# EAGLE design TEK-8x8 (EAGLE 7.2.0)
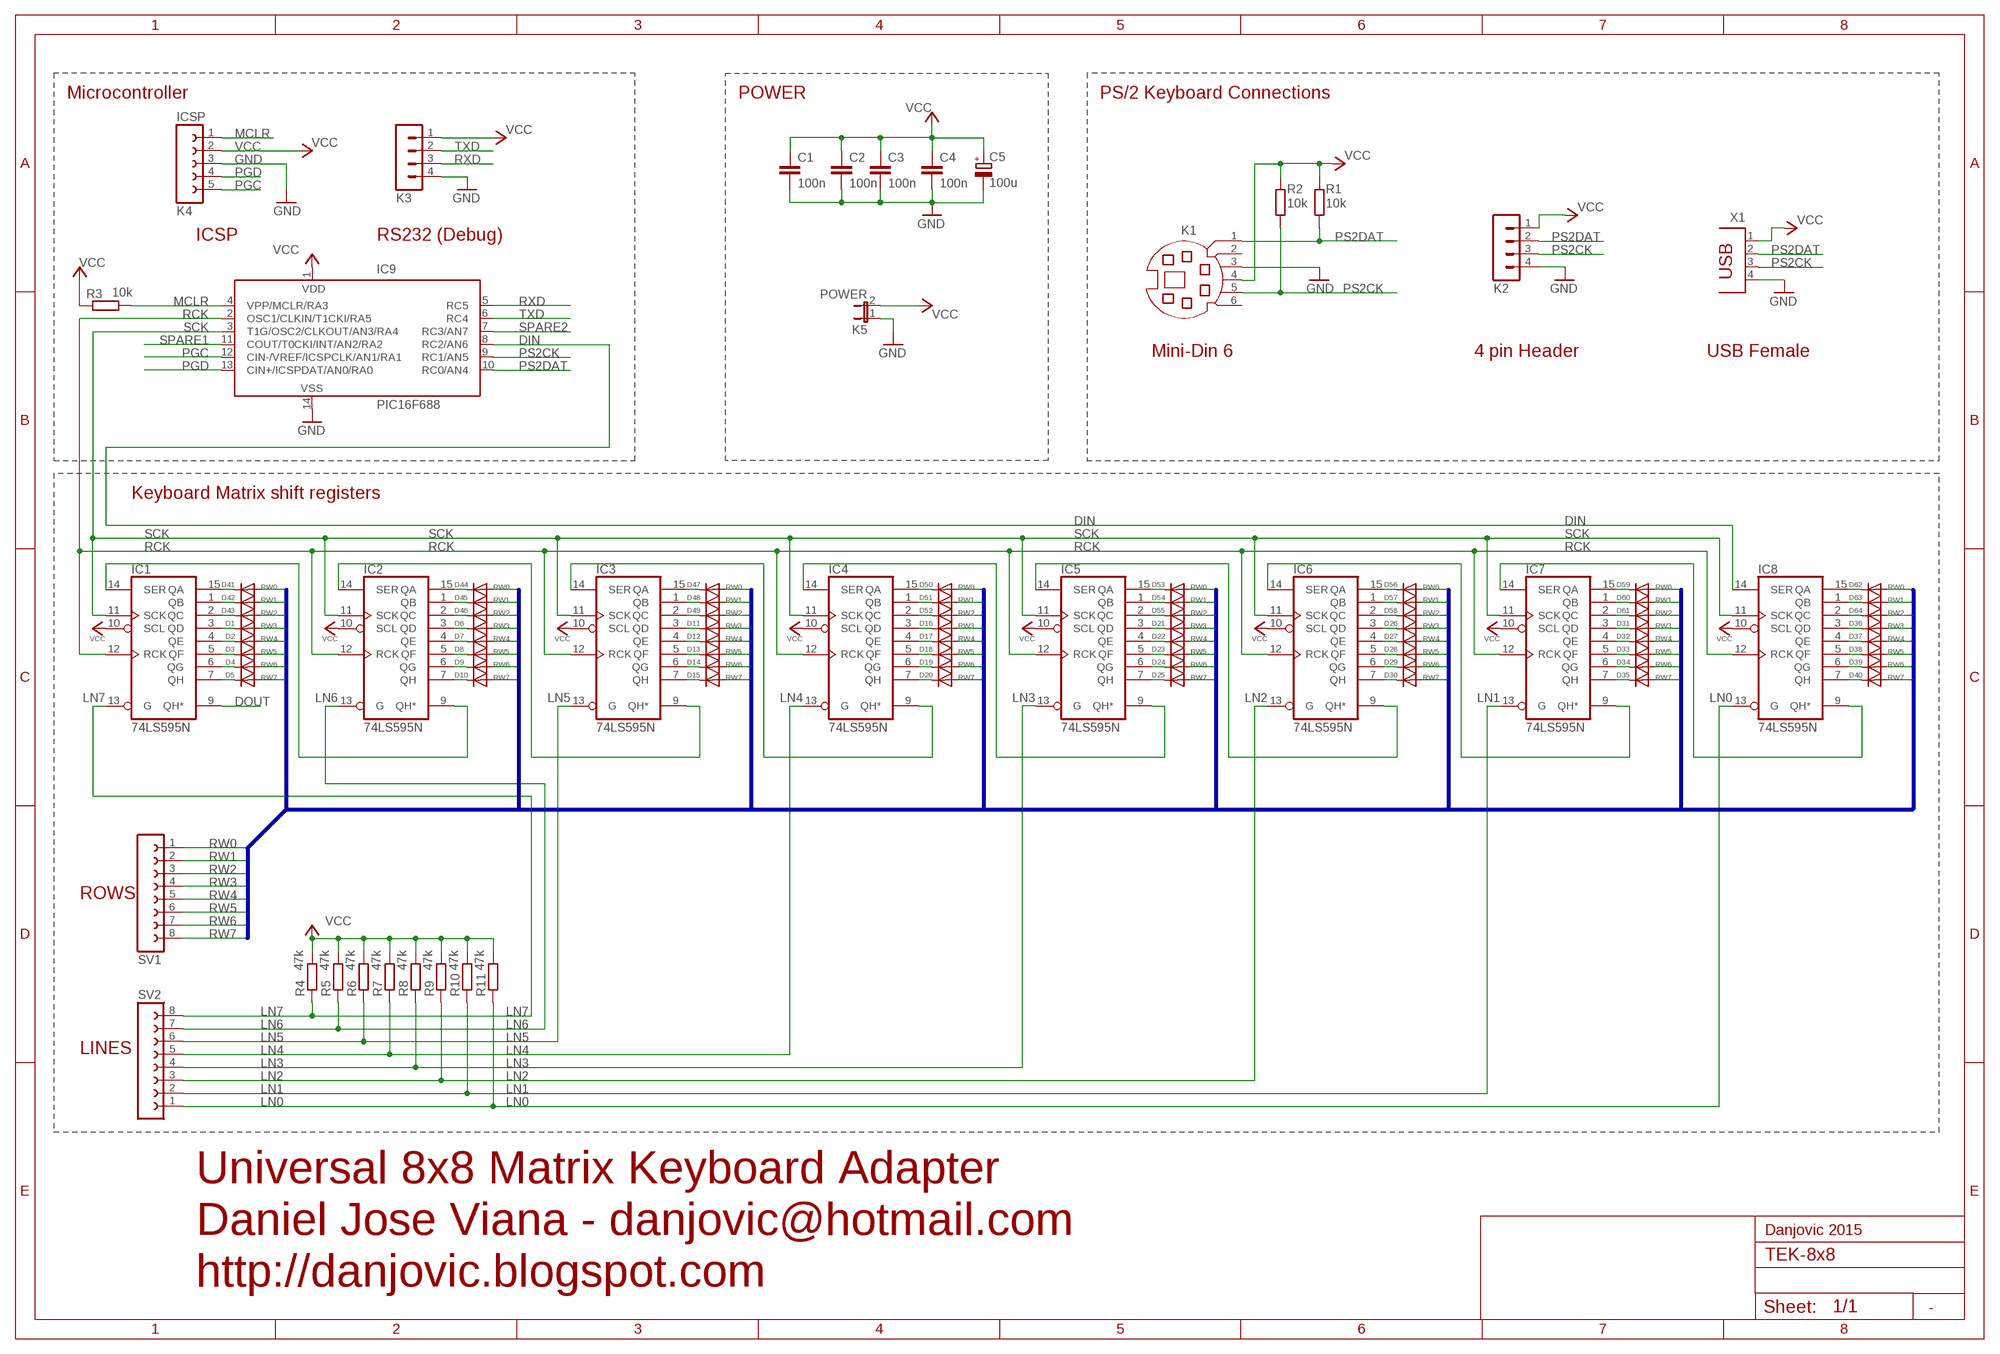
[diagram p0: schematic, sheet 1]

## Parts
C1  100n  C-EU050-030X075  [C050-030X075]
C2  100n  C-EU050-030X075  [C050-030X075]
C3  100n  C-EU050-030X075  [C050-030X075]
C4  100n  C-EU050-030X075  [C050-030X075]
C5  100u  CPOL-EUE3.5-10  [E3,5-10]
D1  DIODE-D-2.5  [D-2.5]
D2  DIODE-D-2.5  [D-2.5]
D3  DIODE-D-2.5  [D-2.5]
D4  DIODE-D-2.5  [D-2.5]
D5  DIODE-D-2.5  [D-2.5]
D6  DIODE-D-2.5  [D-2.5]
D7  DIODE-D-2.5  [D-2.5]
D8  DIODE-D-2.5  [D-2.5]
D9  DIODE-D-2.5  [D-2.5]
D10  DIODE-D-2.5  [D-2.5]
D11  DIODE-D-2.5  [D-2.5]
D12  DIODE-D-2.5  [D-2.5]
D13  DIODE-D-2.5  [D-2.5]
D14  DIODE-D-2.5  [D-2.5]
D15  DIODE-D-2.5  [D-2.5]
D16  DIODE-D-2.5  [D-2.5]
D17  DIODE-D-2.5  [D-2.5]
D18  DIODE-D-2.5  [D-2.5]
D19  DIODE-D-2.5  [D-2.5]
D20  DIODE-D-2.5  [D-2.5]
D21  DIODE-D-2.5  [D-2.5]
D22  DIODE-D-2.5  [D-2.5]
D23  DIODE-D-2.5  [D-2.5]
D24  DIODE-D-2.5  [D-2.5]
D25  DIODE-D-2.5  [D-2.5]
D26  DIODE-D-2.5  [D-2.5]
D27  DIODE-D-2.5  [D-2.5]
D28  DIODE-D-2.5  [D-2.5]
D29  DIODE-D-2.5  [D-2.5]
D30  DIODE-D-2.5  [D-2.5]
D31  DIODE-D-2.5  [D-2.5]
D32  DIODE-D-2.5  [D-2.5]
D33  DIODE-D-2.5  [D-2.5]
D34  DIODE-D-2.5  [D-2.5]
D35  DIODE-D-2.5  [D-2.5]
D36  DIODE-D-2.5  [D-2.5]
D37  DIODE-D-2.5  [D-2.5]
D38  DIODE-D-2.5  [D-2.5]
D39  DIODE-D-2.5  [D-2.5]
D40  DIODE-D-2.5  [D-2.5]
D41  DIODE-D-2.5  [D-2.5]
D42  DIODE-D-2.5  [D-2.5]
D43  DIODE-D-2.5  [D-2.5]
D44  DIODE-D-2.5  [D-2.5]
D45  DIODE-D-2.5  [D-2.5]
D46  DIODE-D-2.5  [D-2.5]
D47  DIODE-D-2.5  [D-2.5]
D48  DIODE-D-2.5  [D-2.5]
D49  DIODE-D-2.5  [D-2.5]
D50  DIODE-D-2.5  [D-2.5]
D51  DIODE-D-2.5  [D-2.5]
D52  DIODE-D-2.5  [D-2.5]
D53  DIODE-D-2.5  [D-2.5]
D54  DIODE-D-2.5  [D-2.5]
D55  DIODE-D-2.5  [D-2.5]
D56  DIODE-D-2.5  [D-2.5]
D57  DIODE-D-2.5  [D-2.5]
D58  DIODE-D-2.5  [D-2.5]
D59  DIODE-D-2.5  [D-2.5]
D60  DIODE-D-2.5  [D-2.5]
D61  DIODE-D-2.5  [D-2.5]
D62  DIODE-D-2.5  [D-2.5]
D63  DIODE-D-2.5  [D-2.5]
D64  DIODE-D-2.5  [D-2.5]
IC1  74LS595N  [DIL16]
IC2  74LS595N  [DIL16]
IC3  74LS595N  [DIL16]
IC4  74LS595N  [DIL16]
IC5  74LS595N  [DIL16]
IC6  74LS595N  [DIL16]
IC7  74LS595N  [DIL16]
IC8  74LS595N  [DIL16]
IC9  PIC16F688  PIC16F676P  [DIL14]
K1  MD06SS  [MDIN06SS]
K2  MA04-1  [MA04-1]
K3  MA04-1  [MA04-1]
K4  ICSP  FE05-1  [FE05-1]
K5  POWER  JP1E  [JP1]
R1  10k  R-EU_0204/7  [0204/7]
R2  10k  R-EU_0204/7  [0204/7]
R3  10k  R-EU_0204/7  [0204/7]
R4  47k  R-EU_0204/7  [0204/7]
R5  47k  R-EU_0204/7  [0204/7]
R6  47k  R-EU_0204/7  [0204/7]
R7  47k  R-EU_0204/7  [0204/7]
R8  47k  R-EU_0204/7  [0204/7]
R9  47k  R-EU_0204/7  [0204/7]
R10  47k  R-EU_0204/7  [0204/7]
R11  47k  R-EU_0204/7  [0204/7]
SV1  FE08-1  [FE08]
SV2  FE08-1  [FE08]
X1  PN87520  [PN87520]

## Nets
DIN: IC8.14(SER) IC9.8(RC2/AN6)
DOUT: IC1.9(QH*)
GND: C1.2 C2.2 C3.2 C4.2 C5.- IC9.14(VSS) K1.3 K2.4 K3.4 K4.3 K5.1 X1.4
LN0: IC8.13(G) R11.1 SV2.1
LN1: IC7.13(G) R10.1 SV2.2
LN2: IC6.13(G) R9.1 SV2.3
LN3: IC5.13(G) R8.1 SV2.4
LN4: IC4.13(G) R7.1 SV2.5
LN5: IC3.13(G) R6.1 SV2.6
LN6: IC2.13(G) R5.1 SV2.7
LN7: IC1.13(G) R4.1 SV2.8
MCLR: IC9.4(VPP/MCLR/RA3) K4.1 R3.1
N$1: D62.C IC8.15(QA)
N$2: D36.C IC8.3(QD)
N$3: D37.C IC8.4(QE)
N$4: D38.C IC8.5(QF)
N$5: D39.C IC8.6(QG)
N$6: D40.C IC8.7(QH)
N$7: D31.C IC7.3(QD)
N$8: D32.C IC7.4(QE)
N$9: D33.C IC7.5(QF)
N$10: D34.C IC7.6(QG)
N$11: D35.C IC7.7(QH)
N$12: IC1.14(SER) IC2.9(QH*)
N$13: D26.C IC6.3(QD)
N$14: D27.C IC6.4(QE)
N$15: D28.C IC6.5(QF)
N$16: IC4.14(SER) IC5.9(QH*)
N$17: D29.C IC6.6(QG)
N$18: IC2.14(SER) IC3.9(QH*)
N$19: D30.C IC6.7(QH)
N$20: D21.C IC5.3(QD)
N$21: D22.C IC5.4(QE)
N$22: D23.C IC5.5(QF)
N$23: IC5.14(SER) IC6.9(QH*)
N$24: D24.C IC5.6(QG)
N$25: D25.C IC5.7(QH)
N$26: D16.C IC4.3(QD)
N$27: D17.C IC4.4(QE)
N$28: D18.C IC4.5(QF)
N$29: IC3.14(SER) IC4.9(QH*)
N$30: D19.C IC4.6(QG)
N$31: D20.C IC4.7(QH)
N$32: D11.C IC3.3(QD)
N$33: D12.C IC3.4(QE)
N$34: D13.C IC3.5(QF)
N$35: D14.C IC3.6(QG)
N$36: D15.C IC3.7(QH)
N$37: D6.C IC2.3(QD)
N$38: D7.C IC2.4(QE)
N$39: D8.C IC2.5(QF)
N$40: D9.C IC2.6(QG)
N$41: D10.C IC2.7(QH)
N$42: D1.C IC1.3(QD)
N$43: D2.C IC1.4(QE)
N$44: IC6.14(SER) IC7.9(QH*)
N$45: D3.C IC1.5(QF)
N$46: D4.C IC1.6(QG)
N$47: D5.C IC1.7(QH)
N$48: D63.C IC8.1(QB)
N$49: IC7.14(SER) IC8.9(QH*)
N$50: D64.C IC8.2(QC)
N$51: D59.C IC7.15(QA)
N$52: D60.C IC7.1(QB)
N$53: D61.C IC7.2(QC)
N$54: D56.C IC6.15(QA)
N$55: D57.C IC6.1(QB)
N$56: D58.C IC6.2(QC)
N$57: D53.C IC5.15(QA)
N$58: D54.C IC5.1(QB)
N$59: D55.C IC5.2(QC)
N$60: D50.C IC4.15(QA)
N$61: D51.C IC4.1(QB)
N$62: D52.C IC4.2(QC)
N$63: D44.C IC2.15(QA)
N$64: D45.C IC2.1(QB)
N$65: D46.C IC2.2(QC)
N$66: D41.C IC1.15(QA)
N$67: D42.C IC1.1(QB)
N$68: D43.C IC1.2(QC)
N$69: D47.C IC3.15(QA)
N$70: D48.C IC3.1(QB)
N$71: D49.C IC3.2(QC)
PGC: IC9.12(CIN-/VREF/ICSPCLK/AN1/RA1) K4.5
PGD: IC9.13(CIN+/ICSPDAT/AN0/RA0) K4.4
PS2CK: IC9.9(RC1/AN5) K1.5 K2.3 R2.1 X1.3
PS2DAT: IC9.10(RC0/AN4) K1.1 K2.2 R1.1 X1.2
RCK: IC1.12(RCK) IC2.12(RCK) IC3.12(RCK) IC4.12(RCK) IC5.12(RCK) IC6.12(RCK) IC7.12(RCK) IC8.12(RCK) IC9.2(OSC1/CLKIN/T1CKI/RA5)
RW0: D41.A D44.A D47.A D50.A D53.A D56.A D59.A D62.A SV1.1
RW1: D42.A D45.A D48.A D51.A D54.A D57.A D60.A D63.A SV1.2
RW2: D43.A D46.A D49.A D52.A D55.A D58.A D61.A D64.A SV1.3
RW3: D1.A D6.A D11.A D16.A D21.A D26.A D31.A D36.A SV1.4
RW4: D2.A D7.A D12.A D17.A D22.A D27.A D32.A D37.A SV1.5
RW5: D3.A D8.A D13.A D18.A D23.A D28.A D33.A D38.A SV1.6
RW6: D4.A D9.A D14.A D19.A D24.A D29.A D34.A D39.A SV1.7
RW7: D5.A D10.A D15.A D20.A D25.A D30.A D35.A D40.A SV1.8
RXD: IC9.5(RC5) K3.3
SCK: IC1.11(SCK) IC2.11(SCK) IC3.11(SCK) IC4.11(SCK) IC5.11(SCK) IC6.11(SCK) IC7.11(SCK) IC8.11(SCK) IC9.3(T1G/OSC2/CLKOUT/AN3/RA4)
SPARE1: IC9.11(COUT/T0CKI/INT/AN2/RA2)
SPARE2: IC9.7(RC3/AN7)
TXD: IC9.6(RC4) K3.2
VCC: C1.1 C2.1 C3.1 C4.1 C5.+ IC1.10(SCL) IC2.10(SCL) IC3.10(SCL) IC4.10(SCL) IC5.10(SCL) IC6.10(SCL) IC7.10(SCL) IC8.10(SCL) IC9.1(VDD) K1.4 K2.1 K3.1 K4.2 K5.2 R1.2 R2.2 R3.2 R4.2 R5.2 R6.2 R7.2 R8.2 R9.2 R10.2 R11.2 X1.1
Unconnected: K1.2 K1.6

## Buses
R[0..7]

## Notes on the sheet
- Microcontroller | POWER | PS/2 Keyboard Connections
- ICSP | RS232 (Debug)
- Mini-Din 6 | 4 pin Header | USB Female
- Keyboard Matrix shift registers
- ROWS
- LINES
- Universal 8x8 Matrix Keyboard Adapter
- Daniel Jose Viana - danjovic@hotmail.com | Danjovic 2015
- http://danjovic.blogspot.com
- -

## Power pins joined to a net without a drawn wire
GND: IC1.8(GND) IC2.8(GND) IC3.8(GND) IC4.8(GND) IC5.8(GND) IC6.8(GND) IC7.8(GND) IC8.8(GND)
VCC: IC1.16(VCC) IC2.16(VCC) IC3.16(VCC) IC4.16(VCC) IC5.16(VCC) IC6.16(VCC) IC7.16(VCC) IC8.16(VCC)

## Library data of the parts
C1-C4 = rcl:C-EU: CAPACITOR, European symbol
C5 = rcl:CPOL-EU: POLARIZED CAPACITOR, European symbol
D1-D64 = diode:DIODE-: DIODE
IC1-IC8 = 74xx-us:74*595: 8-bit SHIFT REGISTER, output latch
IC9 = microchip:PIC16F676: 14-Pin, Flash-Based 8-Bit CMOS Microcontroller High Performance RISC CPU: * Only 35 instructions to learn - All single-cycle instructions except branches * Operating speed: - DC - 20 MHz oscillator/clock input - DC - 200 ns instruction cycle * Internal and external oscillator options - Precision Internal 4 MHz oscillator factory calibrated to ±1% - External Oscillator support for crystals and resonators - 5?s wake-up from SLEEP, 3.0V, typical * Power saving SLEEP mode * Wide operating voltage range - 2.0V to 5.5V * Industrial and Extended temperature range * Low power Power-on Reset (POR) * Power-up Timer (PWRT) and Oscillator Start-up Timer (OST) * Brown-out Detect (BOD) * Watchdog Timer (WDT) with independent oscillator for reliable operation * Multiplexed MCLR/Input-pin * Interrupt-on-pin change * Individual programmable weak pull-ups * Programmable code protection * High Endurance FLASH/EEPROM Cell - 100,000 write FLASH endurance - 1,000,000 write EEPROM endurance - FLASH/Data EEPROM Retention: > 40 years * Standby Current: - 1 nA @ 2.0V, typical * Operating Current: - 8.5?A @ 32 kHz, 2.0V, typical - 100?A @ 1 MHz, 2.0V, typical * Watchdog Timer Current - 300 nA @ 2.0V, typical * Timer1 oscillator current: - 4?A @ 32 kHz, 2.0V, typical * 12 I/O pins with individual direction control * High current sink/source for direct LED drive * Analog-to-Digital Converter module (PIC16F676): - 10-bit resolution - Programmable 8-channel input - Voltage reference input * In-Circuit Serial ProgrammingTM (ICSPTM) via two pins Source: http://ww1.microchip.com/downloads/en/DeviceDoc/40039E.pdf; MF: MICROCHIP; MPN: PIC16F676-I/P; OC_FARNELL: 9760512; OC_NEWARK: 54K2829
K1 = con-yamaichi:MD06SS: YAMAICHI CONNECTOR; OC_FARNELL: unknown; OC_NEWARK: unknown
K2 K3 = con-lstb:MA04-1: PIN HEADER; OC_FARNELL: unknown; OC_NEWARK: unknown
K4 = con-lsta:FE05-1: FEMALE HEADER; OC_FARNELL: unknown; OC_NEWARK: unknown
K5 = jumper:JP1E: JUMPER
R1-R11 = rcl:R-EU_: RESISTOR, European symbol
SV1 SV2 = con-lsta:FE08-1: FEMALE HEADER; OC_FARNELL: unknown; OC_NEWARK: unknown
X1 = con-berg:PN87520: BERG USB connector; OC_FARNELL: unknown; OC_NEWARK: unknown

## Board
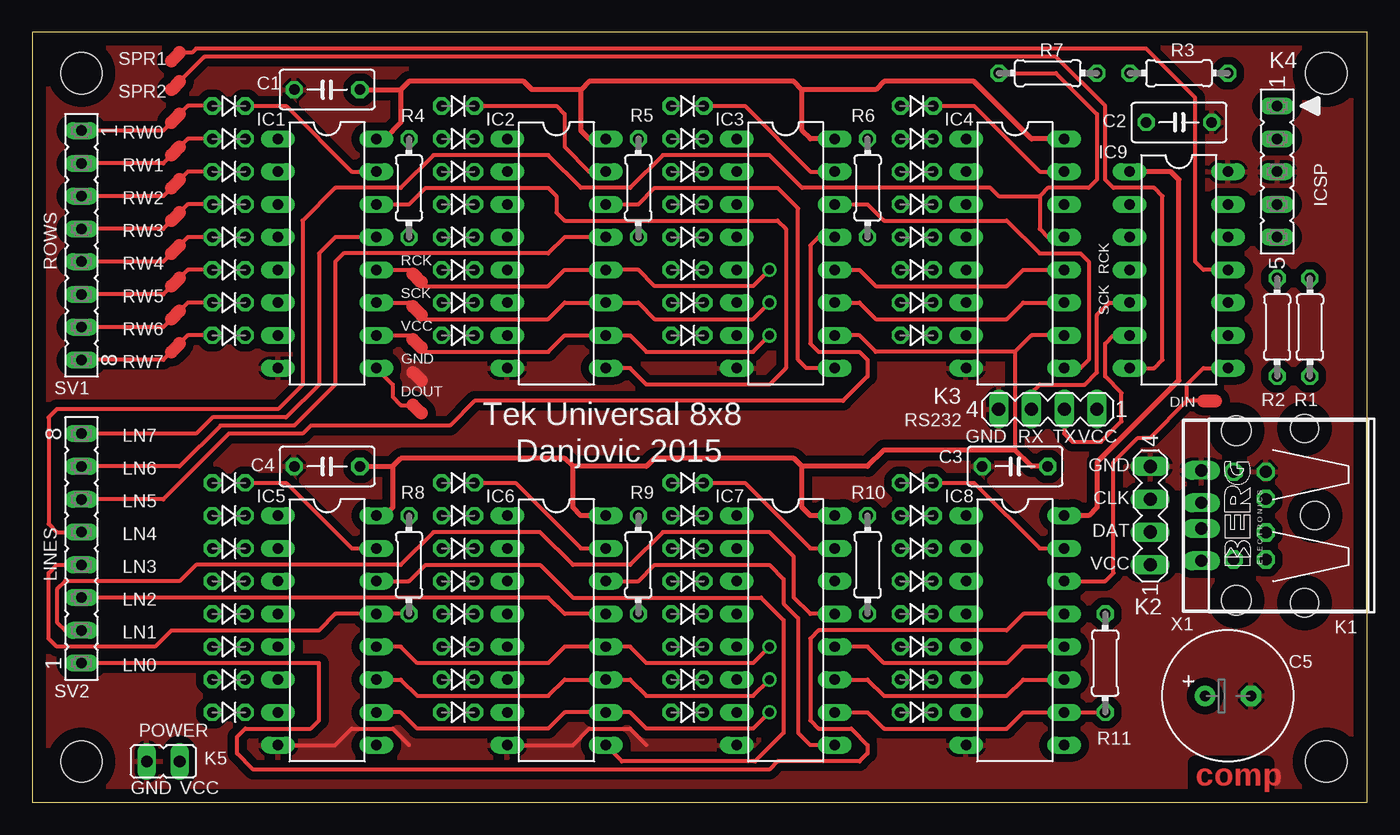
[diagram p1: board, top side]
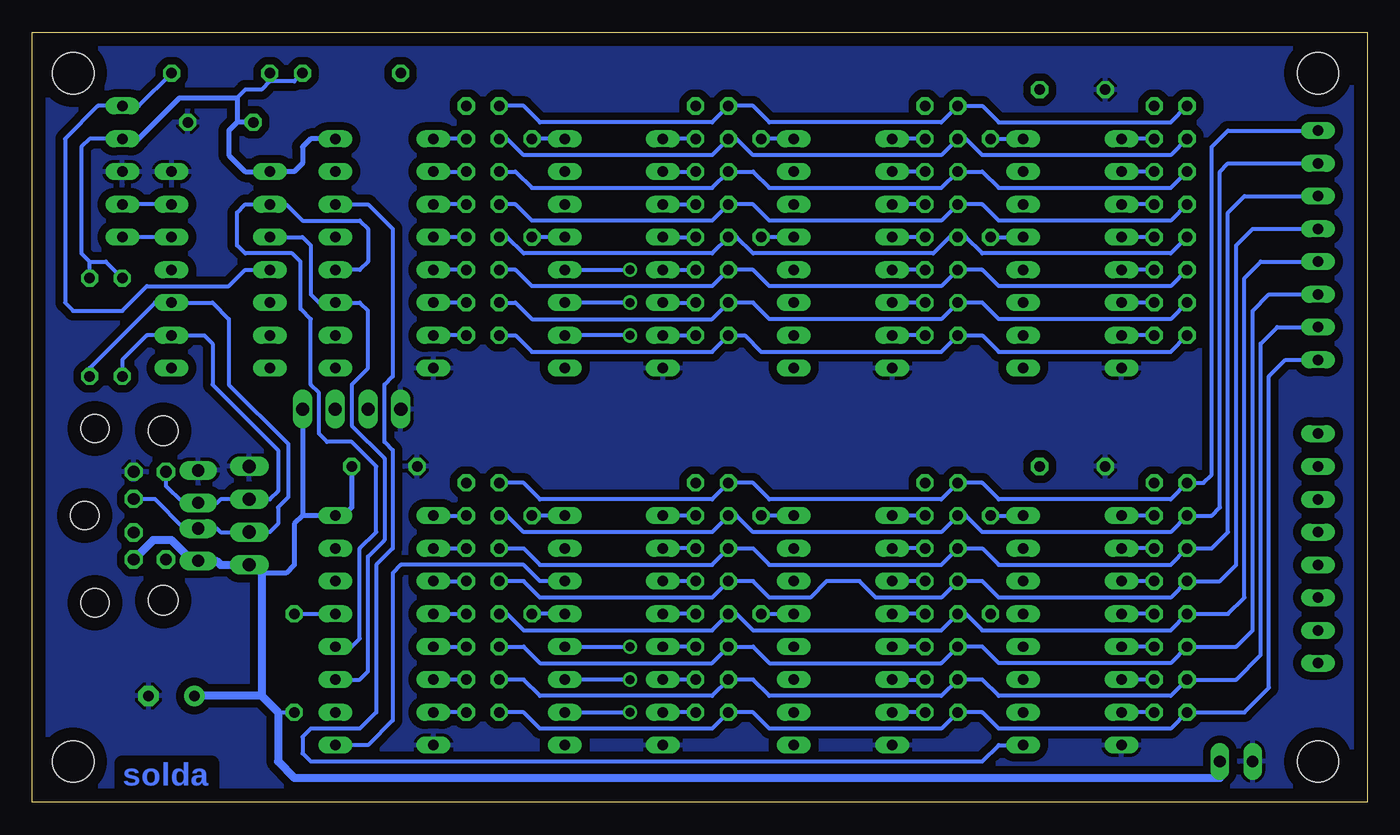
[diagram p2: board, bottom side, seen from below]

Size 103.5 x 59.69 mm. Coordinates in mm from the lower left corner, seen from the top.
Outline: 0,59.69 0,0 103.5,0 103.5,59.69 0,59.69
Copper layers (1*16): Top 0.035mm / dielectric 1.5mm / Bottom 0.035mm
Design rules "default *": minimum track width 10mil, minimum drill 24mil, track to track 8mil, track to pad 8mil, pad to pad 8mil, via to via 8mil, smd to smd 8mil, copper to edge 40mil, drill to drill 8mil, minimum pad ring 10mil, minimum via ring 8mil, stop-mask expansion 4mil, vias tented up to drill 0mil, thermal gap 10mil
Holes 3.2 mm at 100.33,56.51 3.81,56.51 3.81,3.17 100.33,3.17

### Footprints (pad centres in the part's own frame; a part is rotated, then mirrored left to right if it is on the bottom)
C050-030X075 = drill 0.813 octagon: 1 -2.54,0; 2 2.54,0
E3,5-10 = drill 0.813 pad 1.6: + -1.778,0 | drill 0.813 pad 1.6 octagon: - 1.778,0
D-2.5 = drill 0.813 octagon: A 1.27,0; C -1.27,0
DIL16 = drill 0.813 long: 1 -8.89,-3.81; 2 -6.35,-3.81; 3 -3.81,-3.81; 4 -1.27,-3.81; 5 1.27,-3.81; 6 3.81,-3.81; 7 6.35,-3.81; 8 8.89,-3.81; 9 8.89,3.81; 10 6.35,3.81; 11 3.81,3.81; 12 1.27,3.81; 13 -1.27,3.81; 14 -3.81,3.81; 15 -6.35,3.81; 16 -8.89,3.81
DIL14 = drill 0.813 long: 1 -7.62,-3.81; 2 -5.08,-3.81; 3 -2.54,-3.81; 4 0,-3.81; 5 2.54,-3.81; 6 5.08,-3.81; 7 7.62,-3.81; 8 7.62,3.81; 9 5.08,3.81; 10 2.54,3.81; 11 0,3.81; 12 -2.54,3.81; 13 -5.08,3.81; 14 -7.62,3.81
MDIN06SS = drill 0.9 octagon: 1 1.3,8.5; 2 -1.3,8.5; 3 3.4,8.5; 4 -3.4,8.5; 5 3.4,11; 6 -3.4,11 | hole 2.2: -6.75,5.5; 0,4.7; 6.75,5.5
MA04-1 = drill 1.016 long: 1 -3.81,0; 2 -1.27,0; 3 1.27,0; 4 3.81,0
FE05-1 = drill 0.813 long: 1 -5.08,0; 2 -2.54,0; 3 0,0; 4 2.54,0; 5 5.08,0
JP1 = drill 0.914 long: 1 0,-1.27; 2 0,1.27
0204/7 = drill 0.813 octagon: 1 -3.81,0; 2 3.81,0
FE08 = drill 0.813 long: 1 -8.89,0; 2 -6.35,0; 3 -3.81,0; 4 -1.27,0; 5 1.27,0; 6 3.81,0; 7 6.35,0; 8 8.89,0
PN87520 = drill 0.95 long: 1 -3.5,2.71; 2 -1,2.71; 3 1,2.71; 4 3.5,2.71 | hole 2.3: -6.57,0; 6.57,0

### Placement (x,y rotation side)
C1  22.86,55.24 180 top
C2  88.9,52.71 0 top
C3  76.2,26.03 180 top
C4  22.86,26.03 180 top
C5  92.71,8.25 0 top
D1  15.24,46.35 180 top
D2  15.24,43.82 180 top
D3  15.24,41.27 180 top
D4  15.24,38.73 180 top
D5  15.24,36.2 180 top
D6  33.02,46.35 180 top
D7  33.02,43.82 180 top
D8  33.02,41.27 180 top
D9  33.02,38.73 180 top
D10  33.02,36.2 180 top
D11  50.8,46.35 180 top
D12  50.8,43.82 180 top
D13  50.8,41.27 180 top
D14  50.8,38.73 180 top
D15  50.8,36.2 180 top
D16  68.58,46.35 180 top
D17  68.58,43.82 180 top
D18  68.58,41.27 180 top
D19  68.58,38.73 180 top
D20  68.58,36.2 180 top
D21  15.24,17.14 180 top
D22  15.24,14.6 180 top
D23  15.24,12.06 180 top
D24  15.24,9.52 180 top
D25  15.24,6.98 180 top
D26  33.02,17.14 180 top
D27  33.02,14.6 180 top
D28  33.02,12.06 180 top
D29  33.02,9.52 180 top
D30  33.02,6.98 180 top
D31  50.8,17.14 180 top
D32  50.8,14.6 180 top
D33  50.8,12.06 180 top
D34  50.8,9.52 180 top
D35  50.8,6.98 180 top
D36  68.58,17.14 180 top
D37  68.58,14.6 180 top
D38  68.58,12.06 180 top
D39  68.58,9.52 180 top
D40  68.58,6.98 180 top
D41  15.24,53.98 180 top
D42  15.24,51.43 180 top
D43  15.24,48.9 180 top
D44  33.02,53.98 180 top
D45  33.02,51.43 180 top
D46  33.02,48.9 180 top
D47  50.8,53.98 180 top
D48  50.8,51.43 180 top
D49  50.8,48.9 180 top
D50  68.58,53.98 180 top
D51  68.58,51.43 180 top
D52  68.58,48.9 180 top
D53  15.24,24.77 180 top
D54  15.24,22.23 180 top
D55  15.24,19.68 180 top
D56  33.02,24.77 180 top
D57  33.02,22.23 180 top
D58  33.02,19.68 180 top
D59  50.8,24.77 180 top
D60  50.8,22.23 180 top
D61  50.8,19.68 180 top
D62  68.58,24.77 180 top
D63  68.58,22.23 180 top
D64  68.58,19.68 180 top
IC1  22.86,42.54 270 top
IC2  40.64,42.54 270 top
IC3  58.42,42.54 270 top
IC4  76.2,42.54 270 top
IC5  22.86,13.34 270 top
IC6  40.64,13.34 270 top
IC7  58.42,13.34 270 top
IC8  76.2,13.34 270 top
IC9  88.9,41.27 270 top
K1  104.14,22.23 90 top
K2  86.68,22.23 90 top
K3  78.74,30.48 180 top
K4  96.52,48.9 270 top
K5  10.16,3.17 270 top
R1  99.06,36.83 90 top
R2  96.52,36.83 90 top
R3  88.9,56.51 180 top
R4  29.21,47.62 90 top
R5  46.99,47.62 90 top
R6  64.77,47.62 90 top
R7  78.74,56.51 0 top
R8  29.21,18.41 90 top
R9  46.99,18.41 90 top
R10  64.77,18.41 90 top
R11  83.19,10.8 270 top
SV1  3.81,43.18 270 top
SV2  3.81,19.68 90 top
X1  93.34,22.23 90 top

### Tracks (layer width: path | path; a pad name or v marks a point on that pad's centre or on a via)
DIN
  Top 0.305: IC8.14 83.19,17.14 83.82,17.78 83.82,26.35 85.73,28.26 86.68,28.26 89.53,31.12 | 90.81,31.12 89.53,31.12 | 89.53,31.12 89.53,32.38 90.81,33.66 IC9.8
  Top 1.016: 90.81,31.12 91.76,31.12
DOUT
  Top 0.305: IC1.9 27.94,32.38 27.94,31.43 28.57,30.8 29.53,30.8
  Top 1.016: 29.53,30.8 30.16,30.16
GND
  Top 0.305: IC6.8 41.91,4.45 43.18,5.71 46.36,5.71 47.62,4.45 | IC5.8 23.49,4.45 24.76,5.71 27.94,5.71 29.21,4.45
  Top 1.016: 29.53,33.34 30.16,32.7
  pour Bottom (isolate 0.61): 0,0 0,59.69 103.5,59.69 103.5,0
  pour Top (isolate 0.61): 0,0 0,59.69 103.5,59.69 103.5,0
LN0
  Top 0.305: IC8.13 76.84,14.6 75.56,13.34 60.96,13.34 60.33,12.7 60.33,6.35 60.96,5.71 63.5,5.71 64.77,4.45 64.77,3.81 64.14,3.17 57.79,3.17 57.15,2.54 17.14,2.54 15.88,3.81 15.88,5.08 16.51,5.71 21.59,5.71 22.22,6.35 22.22,10.8 SV2.1
  Bottom 0.305: R11.1 IC8.13
LN1
  Top 0.305: IC7.13 60.33,14.6 59.05,15.88 59.05,19.05 57.15,20.95 48.9,20.95 46.36,18.41 41.91,18.41 39.37,20.95 31.11,20.95 28.57,18.41 12.7,18.41 11.43,17.14 2.54,17.14 1.91,16.51 1.91,13.97 2.54,13.34 SV2.2
  Bottom 0.305: IC7.13 R10.1
LN2
  Top 0.305: IC6.13 41.28,14.6 40.01,15.88 SV2.3
  Bottom 0.305: R9.1 IC6.13
LN3
  Top 0.305: R8.1 IC5.13 23.49,14.6 22.22,13.34 10.79,13.34 9.53,12.06 1.91,12.06 1.27,12.7 1.27,17.78 1.91,18.41 SV2.4
LN4
  Top 0.305: 78.11,46.99 74.93,46.99 74.3,47.62 59.69,47.62 57.15,50.16 48.9,50.16 46.36,47.62 42.55,47.62 40.01,50.16 31.11,50.16 28.57,47.62 23.49,47.62 20.95,45.09 20.95,32.38 19.05,30.48 1.91,30.48 1.27,29.84 1.27,21.59 1.91,20.95 SV2.5 | IC4.13 78.74,43.82 78.11,44.45 78.11,46.99 | R7.1 79.38,56.51 82.55,53.34 82.55,48.26 81.92,47.62 78.74,47.62 78.11,46.99
LN5
  Top 0.305: IC3.13 60.96,43.82 60.33,43.18 60.33,35.56 60.96,34.92 64.14,34.92 64.77,34.29 64.77,33.02 62.87,31.12 34.29,31.12 32.38,29.21 21.59,29.21 20.95,28.57 15.24,28.57 10.16,23.49 SV2.6
  Bottom 0.305: IC3.13 R6.1
LN6
  Top 0.305: IC2.13 41.28,43.82 40.01,42.54 24.13,42.54 23.49,41.91 23.49,32.38 20.32,29.21 14.61,29.21 11.43,26.03 SV2.7
  Bottom 0.305: IC2.13 R5.1
LN7
  Top 0.305: IC1.13 23.49,43.82 22.22,42.54 22.22,32.38 19.68,29.84 13.97,29.84 12.7,28.57 SV2.8
  Bottom 0.305: R4.1 IC1.13
MCLR
  Bottom 0.305: R3.1 95.25,53.98 K4.1 98.42,53.98 100.97,51.43 100.97,38.73 100.33,38.1 96.52,38.1 94.62,40 88.27,40 87,41.27 IC9.4
N$1
  Top 0.305: D62.C 73.03,24.77 78.11,19.68 IC8.15
N$2
  Bottom 0.305: IC8.3 D36.C
N$3
  Bottom 0.305: IC8.4 D37.C
N$4
  Bottom 0.305: IC8.5 D38.C
N$5
  Bottom 0.305: D39.C IC8.6
N$6
  Bottom 0.305: D40.C IC8.7
N$7
  Bottom 0.305: D31.C IC7.3
N$8
  Bottom 0.305: D32.C IC7.4
N$9
  Bottom 0.305: D33.C IC7.5
N$10
  Bottom 0.305: D34.C IC7.6
N$11
  Bottom 0.305: D35.C IC7.7
N$12
  Top 0.305: IC1.14 29.21,46.35 30.48,47.62 40.01,47.62 40.64,46.99 40.64,45.72 41.28,45.09 57.79,45.09 58.42,44.45 58.42,33.66 57.15,32.38 47.62,32.38 46.36,33.66 IC2.9
N$13
  Bottom 0.305: D26.C IC6.3
N$14
  Bottom 0.305: D27.C IC6.4
N$15
  Bottom 0.305: D28.C IC6.5
N$16
  Bottom 0.305: IC4.14 77.47,46.35 75.56,44.45 75.56,33.02 76.2,32.38 76.2,27.94 75.56,27.3 75.56,19.68 76.84,18.41 76.84,6.98 78.11,5.71 81.92,5.71 82.55,5.08 82.55,3.81 81.92,3.17 29.84,3.17 28.57,4.45 IC5.9
N$17
  Bottom 0.305: IC6.6 D29.C
N$18
  Top 0.305: IC2.14 46.99,46.35 48.26,47.62 57.79,47.62 59.37,46.04 59.37,34.29 60.01,33.66 IC3.9
N$19
  Bottom 0.305: D30.C IC6.7
N$20
  Bottom 0.305: D21.C IC5.3
N$21
  Bottom 0.305: D22.C IC5.4
N$22
  Bottom 0.305: D23.C IC5.5
N$23
  Top 0.305: IC5.14 29.21,17.14 30.48,18.41 39.37,18.41 41.91,15.88 56.52,15.88 58.26,14.13 58.26,5.4 56.04,3.17 45.72,3.17 IC6.9
N$24
  Bottom 0.305: D24.C IC5.6
N$25
  Bottom 0.305: D25.C IC5.7
N$26
  Bottom 0.305: D16.C IC4.3
N$27
  Bottom 0.305: D17.C IC4.4
N$28
  Bottom 0.305: D18.C IC4.5
N$29
  Top 0.305: IC3.14 64.77,46.35 66.04,45.09 75.56,45.09 78.11,42.54 81.28,42.54 81.92,41.91 81.92,34.29 81.28,33.66 IC4.9
N$30
  Bottom 0.305: D19.C IC4.6
N$31
  Bottom 0.305: D20.C IC4.7
N$32
  Bottom 0.305: IC3.3 D11.C
N$33
  Bottom 0.305: IC3.4 D12.C
N$34
  Bottom 0.305: IC3.5 D13.C
N$35
  Bottom 0.305: IC3.6 D14.C
N$36
  Bottom 0.305: IC3.7 D15.C
N$37
  Bottom 0.305: D6.C IC2.3
N$38
  Bottom 0.305: D7.C IC2.4
N$39
  Bottom 0.305: D8.C IC2.5
N$40
  Bottom 0.305: D9.C IC2.6
N$41
  Bottom 0.305: D10.C IC2.7
N$42
  Bottom 0.305: D1.C IC1.3
N$43
  Bottom 0.305: D2.C IC1.4
N$44
  Top 0.305: IC6.14 46.99,17.14 48.26,18.41 57.15,18.41 58.26,17.3 58.26,15.4 59.37,14.29 59.37,5.4 60.33,4.45 IC7.9
N$45
  Bottom 0.305: D3.C IC1.5
N$46
  Bottom 0.305: D4.C IC1.6
N$47
  Bottom 0.305: D5.C IC1.7
N$48
  Bottom 0.305: IC8.1 D63.C
N$49
  Bottom 0.305: IC7.14 64.14,17.14 65.41,18.41 74.93,18.41 75.56,17.78 75.56,6.35 77.47,4.45 IC8.9
N$50
  Bottom 0.305: IC8.2 D64.C
N$51
  Top 0.305: D59.C 55.25,24.77 60.33,19.68 IC7.15
N$52
  Bottom 0.305: D60.C IC7.1
N$53
  Bottom 0.305: D61.C IC7.2
N$54
  Top 0.305: D56.C 37.47,24.77 42.55,19.68 IC6.15
N$55
  Bottom 0.305: D57.C IC6.1
N$56
  Bottom 0.305: D58.C IC6.2
N$57
  Top 0.305: D53.C 19.68,24.77 24.76,19.68 IC5.15
N$58
  Bottom 0.305: D54.C IC5.1
N$59
  Bottom 0.305: D55.C IC5.2
N$60
  Top 0.305: D50.C 73.03,53.98 78.11,48.9 IC4.15
N$61
  Bottom 0.305: D51.C IC4.1
N$62
  Bottom 0.305: IC4.2 D52.C
N$63
  Top 0.305: D44.C 40.64,53.98 41.28,53.34 41.28,50.8 43.18,48.9 IC2.15
N$64
  Bottom 0.305: D45.C IC2.1
N$65
  Bottom 0.305: D46.C IC2.2
N$66
  Top 0.305: D41.C 19.68,53.98 24.76,48.9 IC1.15
N$67
  Bottom 0.305: D42.C IC1.1
N$68
  Bottom 0.305: D43.C IC1.2
N$69
  Top 0.305: D47.C 55.25,53.98 60.33,48.9 IC3.15
N$70
  Bottom 0.305: D48.C IC3.1
N$71
  Bottom 0.305: IC3.2 D49.C
PGC
  Bottom 0.305: IC9.12 K4.5
PGD
  Bottom 0.305: IC9.13 K4.4
PS2CK
  Bottom 0.305: K1.5 93.14,24.56 91.81,23.23 X1.3 89.17,23.23 88.9,23.49 K2.3 85.09,23.49 84.45,24.13 84.45,27.3 89.53,32.38 89.53,35.56 90.17,36.2 IC9.9 94.62,36.2 96.52,34.29 R2.1
PS2DAT
  Bottom 0.305: K1.1 94.01,23.52 91.71,21.23 X1.2 89.17,21.23 88.9,20.95 K2.2 85.09,20.95 84.45,21.59 84.45,22.86 83.66,23.65 83.66,27.78 88.27,32.38 88.27,37.46 89.53,38.73 IC9.10 93.98,38.73 99.06,33.66 R1.1
RCK  (via drill 0.7)
  Top 0.305: IC1.12 29.21,41.27 29.53,40.96 | 30.16,40.32 30.48,40 40.01,40 41.28,41.27 IC2.12 46.99,41.27 48.26,40 55.88,40 v57.15,41.27 | IC3.12 64.14,41.27 65.41,40 75.56,40 76.84,41.27 IC4.12 | IC8.12 76.84,12.06 75.56,10.8 66.04,10.8 64.77,12.06 IC7.12 | v57.15,12.06 55.88,10.8 47.62,10.8 46.36,12.06 IC6.12 41.28,12.06 40.01,10.8 29.84,10.8 28.57,12.06 IC5.12
  Top 1.016: 29.53,40.96 30.16,40.32
  Bottom 0.305: IC3.12 v57.15,41.27 | IC7.12 v57.15,12.06 | IC8.12 78.74,12.06 78.11,12.7 78.11,19.68 76.84,20.95 76.84,26.03 78.74,27.94 80.64,27.94 81.28,28.57 81.28,31.75 81.92,32.38 81.92,37.46 82.71,38.26 82.71,41.91 83.34,42.54 87,42.54 87.63,43.18 87.63,45.72 87,46.35 IC9.2 83.82,46.35 82.55,45.09 78.11,45.09 77.47,44.45 77.47,41.91 78.11,41.27 IC4.12
RW0
  Top 0.305: D41.A 12.07,53.98 11.43,53.34 | 10.79,52.71 10.16,52.07 SV1.1
  Top 1.016: 11.43,53.34 10.79,52.71
  Bottom 0.305: D41.A 15.24,52.71 28.57,52.71 29.84,53.98 D44.A 33.02,52.71 46.36,52.71 47.62,53.98 D47.A 50.8,52.71 64.14,52.71 65.41,53.98 D50.A | D62.A 65.41,24.77 64.14,23.49 50.8,23.49 D59.A 47.62,24.77 46.36,23.49 33.02,23.49 D56.A 29.84,24.77 28.57,23.49 15.24,23.49 D53.A 12.7,24.77 12.07,25.4 12.07,50.8 10.79,52.07 SV1.1
RW1
  Top 0.305: D42.A 12.07,51.43 11.43,50.8 | 10.79,50.16 10.16,49.53 SV1.2
  Top 1.016: 11.43,50.8 10.79,50.16
  Bottom 0.305: D42.A 15.24,50.16 29.84,50.16 31.11,51.43 D45.A 33.02,50.16 47.62,50.16 48.9,51.43 D48.A 50.8,50.16 65.41,50.16 66.67,51.43 D51.A | D63.A 66.67,22.23 65.41,20.95 50.8,20.95 D60.A 48.9,22.23 47.62,20.95 33.02,20.95 D57.A 31.11,22.23 29.84,20.95 15.24,20.95 D54.A 12.07,22.23 11.43,22.86 11.43,48.9 10.79,49.53 SV1.2
RW2
  Top 0.305: D43.A 12.07,48.9 11.43,48.26 | 10.79,47.62 10.16,46.99 SV1.3
  Top 1.016: 11.43,48.26 10.79,47.62
  Bottom 0.305: D52.A 66.04,48.9 64.77,47.62 50.8,47.62 D49.A 47.62,48.9 46.36,47.62 33.02,47.62 D46.A 29.84,48.9 28.57,47.62 15.24,47.62 D43.A | D64.A 65.41,19.68 64.14,18.41 50.8,18.41 D61.A 47.62,19.68 46.36,18.41 33.02,18.41 D58.A 29.84,19.68 28.57,18.41 15.24,18.41 D55.A 12.07,19.68 10.79,20.95 10.79,45.72 9.53,46.99 SV1.3
RW3
  Top 0.305: D1.A 12.07,46.35 11.43,45.72 | 10.79,45.09 10.16,44.45 SV1.4
  Top 1.016: 11.43,45.72 10.79,45.09
  Bottom 0.305: D1.A 15.24,45.09 28.57,45.09 29.84,46.35 D6.A 33.02,45.09 46.36,45.09 47.62,46.35 D11.A 50.8,45.09 64.77,45.09 66.04,46.35 D16.A | D36.A 65.41,17.14 64.14,15.88 50.8,15.88 D31.A 47.62,17.14 46.36,15.88 43.18,15.88 41.91,17.14 39.37,17.14 38.1,15.88 33.02,15.88 D26.A 29.84,17.14 28.57,15.88 15.24,15.88 D21.A 11.43,17.14 10.16,18.41 10.16,43.18 8.89,44.45 SV1.4
RW4
  Top 0.305: D2.A 12.07,43.82 11.43,43.18 | 10.79,42.54 10.16,41.91 SV1.5
  Top 1.016: 11.43,43.18 10.79,42.54
  Bottom 0.305: D2.A 15.24,42.54 29.84,42.54 31.11,43.82 D7.A 32.38,43.82 33.66,42.54 47.62,42.54 48.9,43.82 D12.A 50.8,42.54 65.41,42.54 66.67,43.82 D17.A | D37.A 66.67,14.6 65.41,13.34 50.8,13.34 D32.A 48.9,14.6 47.62,13.34 33.02,13.34 D27.A 31.11,14.6 29.84,13.34 15.24,13.34 D22.A 10.79,14.6 9.53,15.88 9.53,40.64 8.26,41.91 SV1.5
RW5
  Top 0.305: D3.A 12.07,41.27 11.43,40.64 | 10.79,40 10.16,39.37 SV1.6
  Top 1.016: 11.43,40.64 10.79,40
  Bottom 0.305: D3.A 15.24,40 28.57,40 29.84,41.27 D8.A 33.02,40 46.36,40 47.62,41.27 D13.A 50.8,40 64.77,40 66.04,41.27 D18.A | D38.A 65.41,12.06 64.14,10.8 50.8,10.8 D33.A 47.62,12.06 46.36,10.8 33.02,10.8 D28.A 29.84,12.06 28.57,10.8 15.24,10.8 D23.A 10.16,12.06 8.89,13.34 8.89,38.1 7.62,39.37 SV1.6
RW6
  Top 0.305: D4.A 12.07,38.73 11.43,38.1 | 10.79,37.46 10.16,36.83 SV1.7
  Top 1.016: 11.43,38.1 10.79,37.46
  Bottom 0.305: D4.A 15.24,37.46 28.57,37.46 29.84,38.73 D9.A 33.02,37.46 46.36,37.46 47.62,38.73 D14.A 50.8,37.46 64.77,37.46 66.04,38.73 D19.A | D39.A 65.41,9.52 64.14,8.25 50.8,8.25 D34.A 47.62,9.52 46.36,8.25 33.02,8.25 D29.A 29.84,9.52 28.57,8.25 15.24,8.25 D24.A 10.16,9.52 8.26,11.43 8.26,35.56 6.98,36.83 SV1.7
RW7
  Top 0.305: D5.A 12.07,36.2 11.43,35.56 | 10.79,34.92 10.16,34.29 SV1.8
  Top 1.016: 11.43,35.56 10.79,34.92
  Bottom 0.305: D20.A 66.04,36.2 64.77,34.92 50.8,34.92 D15.A 48.26,36.2 46.99,34.92 33.02,34.92 D10.A 29.84,36.2 28.57,34.92 15.24,34.92 D5.A | D40.A 65.41,6.98 64.14,5.71 50.8,5.71 D35.A 47.62,6.98 46.36,5.71 33.02,5.71 D30.A 29.84,6.98 28.57,5.71 15.24,5.71 D25.A 9.53,6.98 7.62,8.89 7.62,33.02 6.35,34.29 SV1.8
RXD
  Top 0.305: K3.3 77.47,31.75 78.11,32.38 81.6,32.38 82.55,33.34 82.55,37.78 83.5,38.73 IC9.5
SCK  (via drill 0.7)
  Top 0.305: IC1.11 29.21,38.73 29.53,38.42 | 30.16,37.78 30.48,37.46 40.01,37.46 41.28,38.73 IC2.11 46.99,38.73 48.26,37.46 55.88,37.46 v57.15,38.73 | IC3.11 64.14,38.73 65.41,37.46 75.56,37.46 76.84,38.73 IC4.11 | IC5.11 28.57,9.52 29.84,8.25 40.01,8.25 41.28,9.52 IC6.11 46.36,9.52 47.62,8.25 55.88,8.25 v57.15,9.52 | IC7.11 64.77,9.52 66.04,8.25 75.56,8.25 76.84,9.52 IC8.11
  Top 1.016: 29.53,38.42 30.16,37.78
  Bottom 0.305: v57.15,38.73 IC3.11 | v57.15,9.52 IC7.11 | IC8.11 78.11,9.52 77.47,10.16 77.47,19.05 76.2,20.32 76.2,26.67 78.74,29.21 78.74,32.38 77.47,33.66 77.47,38.1 78.11,38.73 IC4.11 81.28,38.73 81.92,39.37 81.92,43.18 82.55,43.82 IC9.3
SPARE1
  Top 0.305: IC9.11 90.81,41.27 90.17,41.91 90.17,54.61 86.36,58.42 12.7,58.42 12.38,58.1 11.43,58.1
  Top 1.016: 10.79,57.47 11.43,58.1
SPARE2
  Top 0.305: IC9.7 87,33.66 87.63,34.29 87.63,46.99 87,47.62 83.82,47.62 83.19,48.26 83.19,53.98 79.38,57.79 13.34,57.79 11.43,55.88
  Top 1.016: 10.79,55.24 11.43,55.88
TXD
  Top 0.305: K3.2 80.01,28.57 80.64,27.94 82.87,27.94 84.45,29.53 84.45,31.75 83.19,33.02 83.19,35.56 83.82,36.2 IC9.6
VCC  (via drill 0.7)
  Top 0.305: IC1.10 29.21,36.2 29.53,35.88 | 30.16,35.24 30.48,34.92 40.01,34.92 41.28,36.2 IC2.10 | 45.09,36.2 IC2.10 | IC2.10 46.36,36.2 47.62,34.92 55.88,34.92 v57.15,36.2 | v57.15,6.98 55.88,5.71 47.62,5.71 46.36,6.98 IC6.10 41.28,6.98 40.01,5.71 29.84,5.71 28.57,6.98 IC5.10 | IC7.10 64.77,6.98 66.04,5.71 75.56,5.71 76.84,6.98 IC8.10 R11.2 | IC4.10 77.47,36.2 76.2,34.92 | 76.2,34.92 65.41,34.92 64.14,36.2 IC3.10 | 76.2,34.92 76.2,27.3
  Top 0.406: C1.1 28.57,55.24 | 28.57,55.24 28.57,52.71 27.3,51.43 IC1.16 | IC2.16 43.18,51.43 42.55,52.07 42.55,55.24 | 28.57,55.24 29.21,55.88 38.1,55.88 38.73,55.24 42.55,55.24 | IC3.16 60.33,51.43 59.69,52.07 59.69,55.24 | 59.69,55.24 59.05,55.88 43.18,55.88 42.55,55.24 | IC4.16 77.47,51.43 73.03,55.88 66.04,55.88 65.41,55.24 59.69,55.24 | C4.1 27.94,26.03 | 27.94,26.03 27.94,22.86 27.3,22.23 IC5.16 | 27.94,26.03 28.57,26.67 41.28,26.67 41.91,26.03 | IC6.16 42.55,22.23 41.91,22.86 41.91,26.03 | IC7.16 60.33,22.23 59.69,22.86 59.69,26.03 | 41.91,26.03 47.62,26.03 48.26,26.67 59.05,26.67 59.69,26.03 | C3.1 77.47,26.03 76.2,27.3 66.04,27.3 64.77,26.03 59.69,26.03 | IC9.1 88.27,48.9 88.9,48.26 88.9,32.7 82.55,26.35 82.55,22.86 81.92,22.23 IC8.16
  Top 1.016: 29.53,35.88 30.16,35.24
  Bottom 0.305: R3.2 85.09,55.88 | 85.09,55.88 85.73,55.24 87,55.24 87.63,54.61 | K4.2 99.06,51.43 99.7,50.8 99.7,42.54 99.06,41.91 | 99.06,41.91 97.79,41.91 R2.2 | R1.2 99.06,41.91 | R4.2 IC1.16 | IC2.16 R5.2 | IC3.16 R6.2 | IC7.16 R10.2 | IC6.16 R9.2 | R8.2 IC5.16 | v57.15,36.2 IC3.10 | IC7.10 v57.15,6.98 | 84.45,6.98 R11.2 | R7.2 83.19,55.88 85.09,55.88
  Bottom 0.406: 87.63,52.71 88.27,52.07 88.27,50.16 87,48.9 IC9.1 83.19,48.9 82.55,49.53 82.55,50.8 81.92,51.43 IC4.16 | C2.1 87.63,52.71 | 87.63,52.71 87.63,54.61 92.08,54.61 95.25,51.43 K4.2 | C3.1 78.74,22.86 79.38,22.23 IC8.16 82.55,22.23 | 82.55,22.23 83.19,21.59 83.19,18.41 83.82,17.78 85.73,17.78 | K3.1 82.55,22.23
  Bottom 0.61: K1.4 94.14,20.32 92.71,20.32 91.12,18.73 X1.1 89.21,18.73 88.9,18.41 K2.1 86.36,18.41 85.73,17.78 85.73,8.25 | 85.73,8.25 84.45,6.98 84.45,3.17 83.19,1.9 11.43,1.9 K5.2 | 85.73,8.25 C5.+

### Text on the board
Top: comp
Bottom: solda
tPlace: SPR1 | SPR2 | RW0 | ICSP | RW1 | RW2 | RW3 | ROWS | RW4 | RCK | RCK | RW5 | SCK | SCK | VCC | RW6 | RW7 | GND | DOUT | DIN | RS232 | Tek Universal 8x8 | GND | RX | TX | VCC | LN7 | Danjovic 2015 | GND | LN6 | CLK | LN5 | DAT | LN4 | VCC | LN3 | LINES | LN2 | LN1 | LN0 | POWER | GND | VCC
tDocu: Adaptador de teclado PS/2 para TK90X | por Daniel José Viana - danjovic@hotmail.com | Placa projetada para encaixar na interface M1 | Conector PS/2 soldado | na face oposta da placa